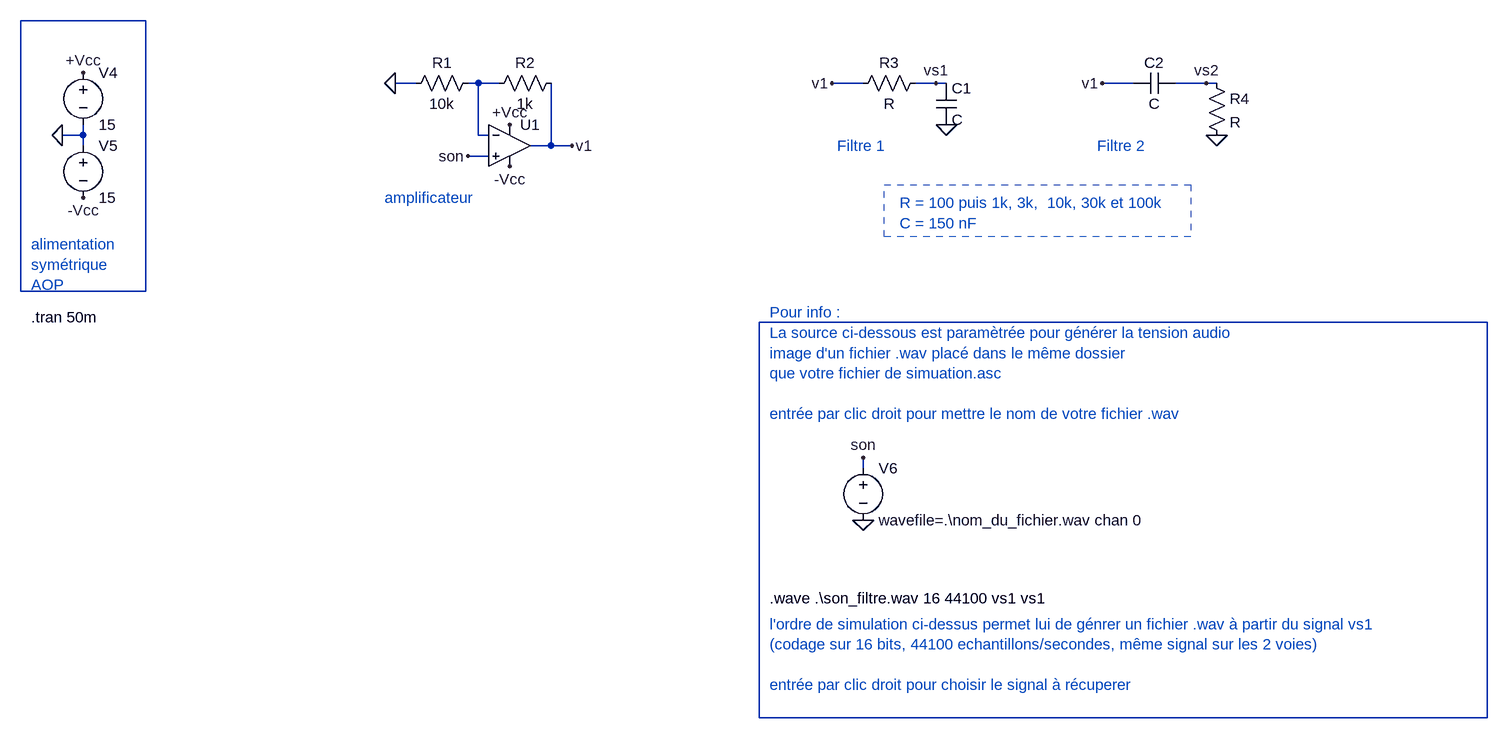
[diagram p0: schematic filtrage_sur_fichiers_wav.asc]
filtrage_sur_fichiers_wav.asc, the LTspice schematic file:
Version 4
SHEET 1 1892 680
WIRE -688 -1360 -880 -1360
WIRE -272 -1264 -304 -1264
WIRE -176 -1264 -192 -1264
WIRE -144 -1264 -176 -1264
WIRE 416 -1264 368 -1264
WIRE 528 -1264 496 -1264
WIRE 544 -1264 528 -1264
WIRE 832 -1264 784 -1264
WIRE 944 -1264 896 -1264
WIRE 960 -1264 944 -1264
WIRE -784 -1184 -784 -1200
WIRE -784 -1184 -816 -1184
WIRE -176 -1184 -176 -1264
WIRE -160 -1184 -176 -1184
WIRE -784 -1168 -784 -1184
WIRE -64 -1168 -64 -1264
WIRE -64 -1168 -96 -1168
WIRE -32 -1168 -64 -1168
WIRE -160 -1152 -192 -1152
WIRE -880 -944 -880 -1360
WIRE -688 -944 -688 -1360
WIRE -688 -944 -880 -944
WIRE 1376 -896 256 -896
WIRE 416 -672 416 -688
WIRE 256 -288 256 -896
WIRE 1376 -288 1376 -896
WIRE 1376 -288 256 -288
FLAG -192 -1152 son
FLAG -32 -1168 v1
FLAG -816 -1184 0
FLAG -784 -1280 +Vcc
FLAG -128 -1200 +Vcc
FLAG -784 -1088 -Vcc
FLAG -128 -1136 -Vcc
FLAG -304 -1264 0
FLAG 960 -1184 0
FLAG 544 -1200 0
FLAG 368 -1264 v1
FLAG 784 -1264 v1
FLAG 528 -1264 vs1
FLAG 944 -1264 vs2
FLAG 416 -592 0
FLAG 416 -688 son
SYMBOL res -288 -1248 R270
WINDOW 0 32 56 VTop 2
WINDOW 3 0 56 VBottom 2
SYMATTR InstName R1
SYMATTR Value 10k
SYMBOL res -160 -1248 R270
WINDOW 0 32 56 VTop 2
WINDOW 3 0 56 VBottom 2
SYMATTR InstName R2
SYMATTR Value 1k
SYMBOL UniversalOpamp2 -128 -1168 R0
WINDOW 0 16 -32 Left 2
SYMATTR InstName U1
SYMBOL voltage -784 -1296 R0
WINDOW 123 0 0 Left 2
WINDOW 39 0 0 Left 2
SYMATTR InstName V4
SYMATTR Value 15
SYMBOL voltage -784 -1184 R0
WINDOW 123 0 0 Left 2
WINDOW 39 0 0 Left 2
SYMATTR InstName V5
SYMATTR Value 15
SYMBOL res 400 -1248 R270
WINDOW 0 32 56 VTop 2
WINDOW 3 0 56 VBottom 2
SYMATTR InstName R3
SYMBOL res 944 -1280 R0
WINDOW 0 36 40 Left 2
WINDOW 3 36 76 Left 2
SYMATTR InstName R4
SYMBOL cap 528 -1264 R0
SYMATTR InstName C1
SYMBOL cap 832 -1248 R270
WINDOW 0 32 32 VTop 2
WINDOW 3 0 32 VBottom 2
SYMATTR InstName C2
SYMBOL voltage 416 -688 R0
SYMATTR InstName V6
SYMATTR Value wavefile=.\nom_du_fichier.wav chan 0
TEXT -864 -904 Left 2 !.tran 50m
TEXT -864 -1016 Left 2 ;alimentation\nsymétrique \nAOP
TEXT 376 -1168 Left 2 ;Filtre 1
TEXT 776 -1168 Left 2 ;Filtre 2
TEXT -320 -1088 Left 2 ;amplificateur
TEXT 272 -472 Left 2 !.wave .\\son_filtre.wav 16 44100 vs1 vs1
TEXT 272 -880 Left 2 ;La source ci-dessous est paramètrée pour générer la tension audio\nimage d'un fichier .wav placé dans le même dossier\nque votre fichier de simuation.asc\n \nentrée par clic droit pour mettre le nom de votre fichier .wav
TEXT 272 -432 Left 2 ;l'ordre de simulation ci-dessus permet lui de génrer un fichier .wav à partir du signal vs1\n(codage sur 16 bits, 44100 echantillons/secondes, même signal sur les 2 voies)\n \nentrée par clic droit pour choisir le signal à récuperer
TEXT 272 -912 Left 2 ;Pour info :
TEXT 472 -1080 Left 2 ;R = 100 puis 1k, 3k,  10k, 30k et 100k\nC = 150 nF
RECTANGLE Normal 448 -1108 920 -1028 2

The netlist it stands for:
* filtrage_sur_fichiers_wav.asc
R1 0 N002 10k
R2 N002 v1 1k
XU1 son N002 +Vcc -Vcc v1 level.2 Avol=1Meg GBW=10Meg Slew=10Meg ilimit=25m rail=0 Vos=0 phimargin=45 en=0 enk=0 in=0 ink=0 Rin=500Meg  ; pins IN+ IN- V+ V- OUT
V4 +Vcc 0 15
V5 0 -Vcc 15
R3 v1 vs1 R
R4 vs2 0 R
C1 vs1 0 C
C2 v1 vs2 C
V6 son 0 wavefile=.\nom_du_fichier.wav chan 0
.tran 50m
* alimentation
* symétrique
* AOP
* Filtre 1
* Filtre 2
* amplificateur
.wave .\son_filtre.wav 16 44100 vs1 vs1
* La source ci-dessous est paramètrée pour générer la tension audio
* image d'un fichier .wav placé dans le même dossier
* que votre fichier de simuation.asc
* entrée par clic droit pour mettre le nom de votre fichier .wav
* l'ordre de simulation ci-dessus permet lui de génrer un fichier .wav à partir du signal vs1
* (codage sur 16 bits, 44100 echantillons/secondes, même signal sur les 2 voies)
* entrée par clic droit pour choisir le signal à récuperer
* Pour info :
* R = 100 puis 1k, 3k,  10k, 30k et 100k
* C = 150 nF
.lib UniversalOpamps2.sub
.backanno
.end